# EAGLE schematic untitled (EAGLE 9.6.2)
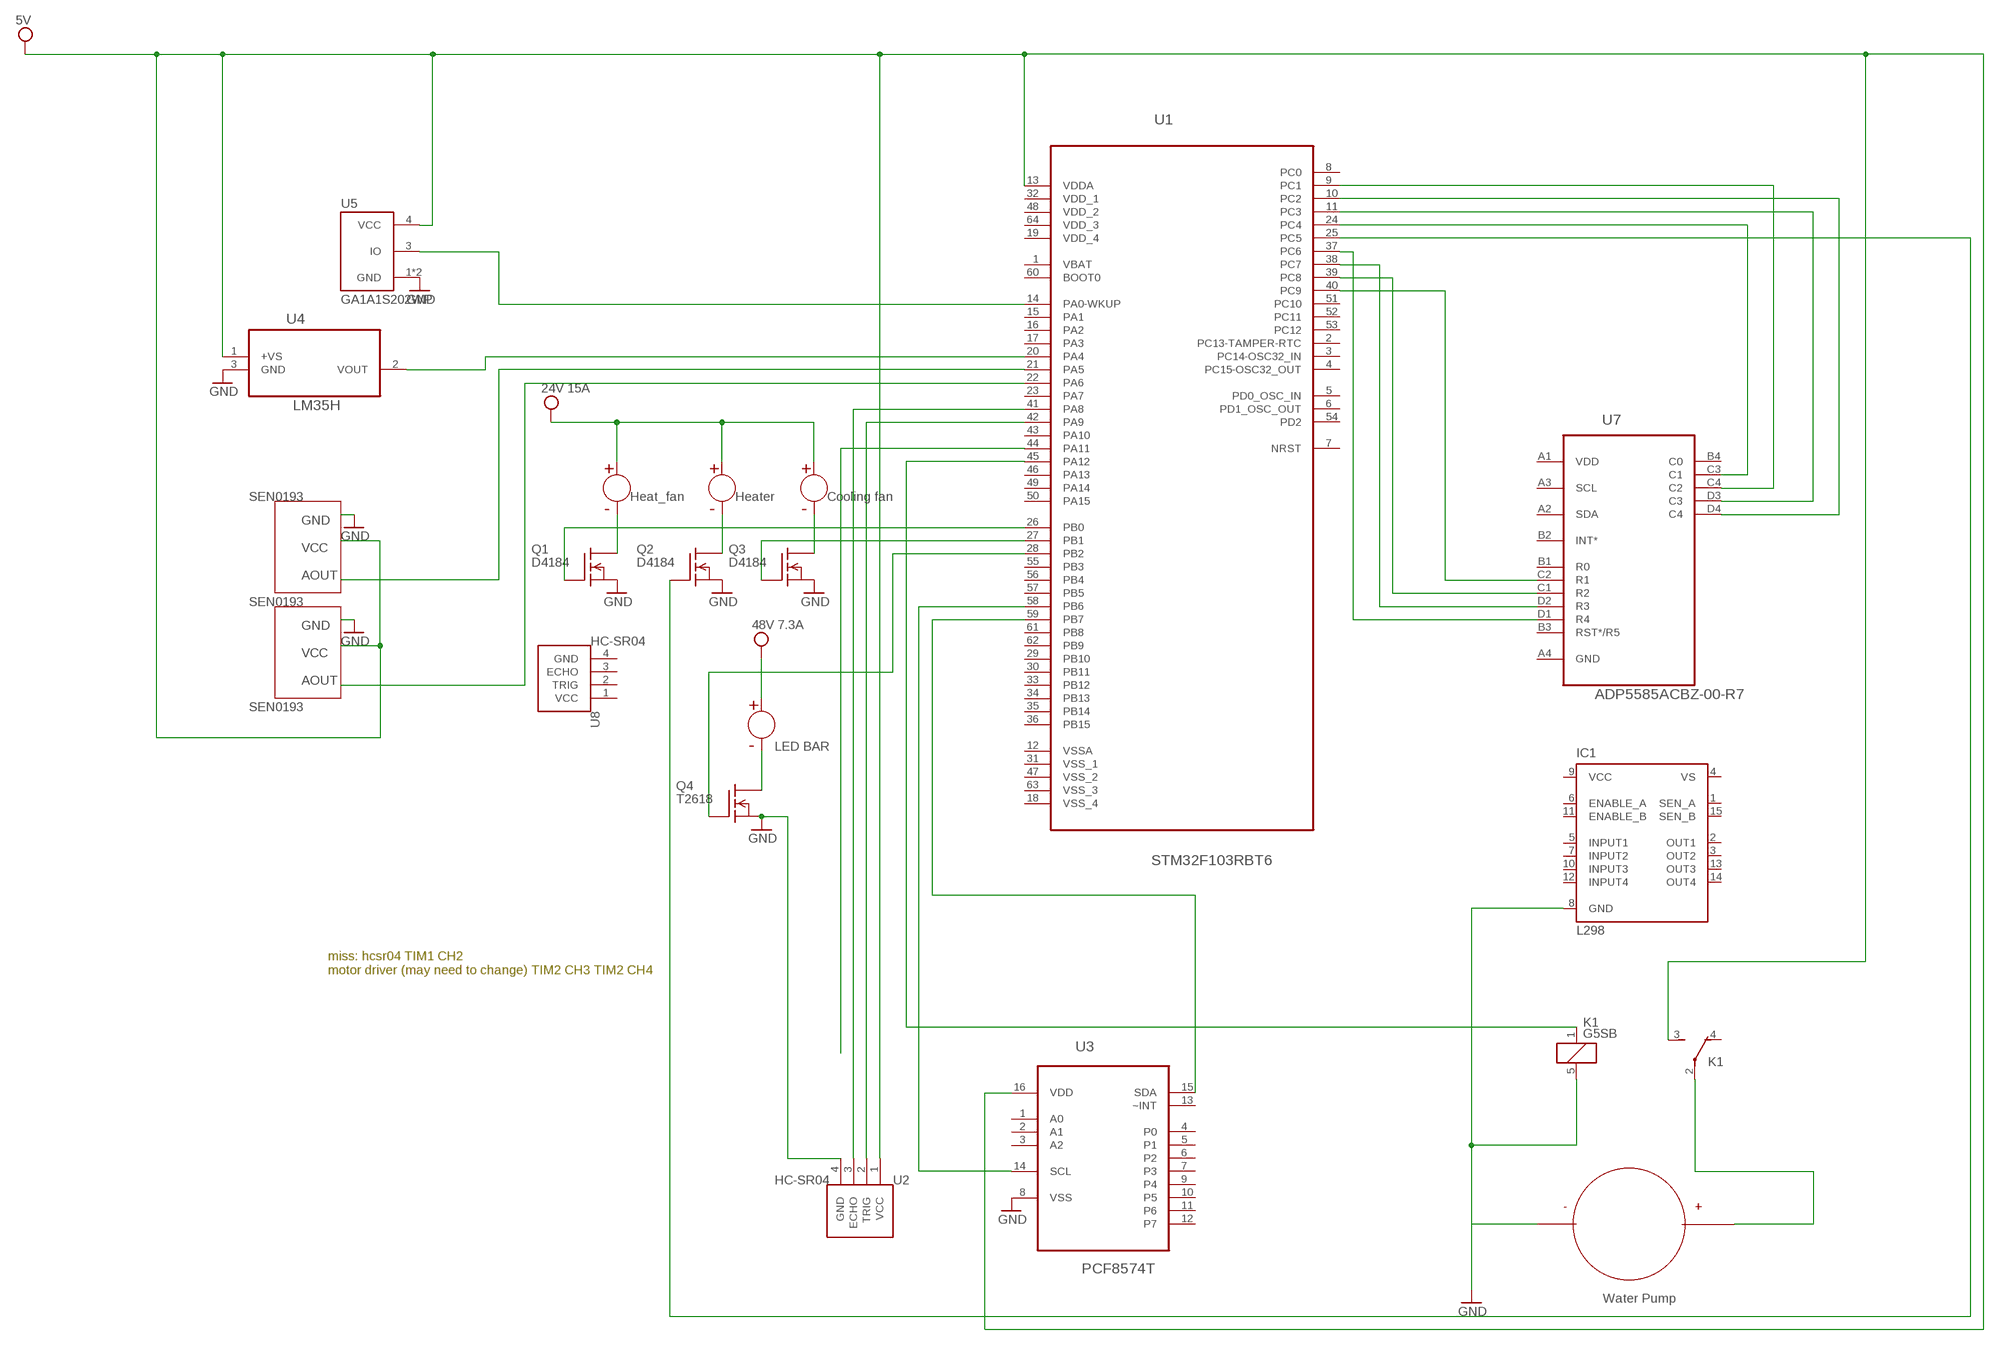
[diagram p0: schematic, sheet 1]

## Parts
IC1  L298  [MULTIWATT-15]
K1  G5SB  [G5SB]
Q1  D4184  BSS101  [TO92]
Q2  D4184  BSS101  [TO92]
Q3  D4184  BSS101  [TO92]
Q4  T2618  BSS101  [TO92]
U1  STM32F103RBT6  [QFP50P1200X1200X160-64N]
U2  HC-SR04  [XCVR_HC-SR04]
U3  PCF8574T  [SOIC127P1032X265-16N]
U4  LM35H  [TO127P543X266-3P]
U5  GA1A1S202WP  [XDCR_GA1A1S202WP]
U7  ADP5585ACBZ-00-R7  [BGA16C40P4X4_159X159X54]
U8  HC-SR04  [XCVR_HC-SR04]

## Nets
GND: IC1.8(GND) K1.5 Q1.1(S) Q2.1(S) Q3.1(S) Q4.1(S) U2.4(GND) U3.8(VSS) U4.3(GND) U5.1(GND) U5.2(GND)
N$1: U1.14(PA0-WKUP) U5.3(IO)
N$2: U1.20(PA4) U4.2(VOUT)
N$3: U1.22(PA6)
N$4: U1.21(PA5)
N$5: K1.1 U1.45(PA12)
N$6: U1.24(PC4) U7.C3(C1)
N$7: Q1.2(G) U1.26(PB0)
N$8: Q1.3(D)
N$9: Q2.2(G) U1.25(PC5)
N$10: Q2.3(D)
N$11: Q3.2(G) U1.27(PB1)
N$12: Q3.3(D)
N$13: Q4.3(D)
N$14: Q4.2(G) U1.28(PB2)
N$15: U1.41(PA8) U2.3(ECHO)
N$16: U1.42(PA9) U2.2(TRIG)
N$17: U1.58(PB6) U3.14(SCL)
N$18: U1.59(PB7) U3.15(SDA)
N$19: U1.40(PC9) U7.C2(R1)
N$20: U1.39(PC8) U7.C1(R2)
N$21: U1.38(PC7) U7.D2(R3)
N$22: U1.37(PC6) U7.D1(R4)
N$23: U1.9(PC1) U7.C4(C2)
N$24: U1.11(PC3) U7.D3(C3)
N$25: U1.10(PC2) U7.D4(C4)
N$27: U1.44(PA11)
N$29: K1.2(U:P)
VCC: K1.3(U:S) U1.13(VDDA) U2.1(VCC) U3.16(VDD) U4.1(+VS) U5.4(VCC) ; supply symbol labelled 5V, 24V 15A, 48V 7.3A
Unconnected: IC1.1(SEN_A) IC1.2(OUT1) IC1.3(OUT2) IC1.5(INPUT1) IC1.6(ENABLE_A) IC1.7(INPUT2) IC1.10(INPUT3) IC1.11(ENABLE_B) IC1.12(INPUT4) IC1.13(OUT3) IC1.14(OUT4) IC1.15(SEN_B) K1.4(U:O) U1.1(VBAT) U1.2(PC13-TAMPER-RTC) U1.3(PC14-OSC32_IN) U1.4(PC15-OSC32_OUT) U1.5(PD0_OSC_IN) U1.6(PD1_OSC_OUT) U1.7(NRST) U1.8(PC0) U1.12(VSSA) U1.15(PA1) U1.16(PA2) U1.17(PA3) U1.18(VSS_4) U1.23(PA7) U1.29(PB10) U1.30(PB11) U1.31(VSS_1) U1.33(PB12) U1.34(PB13) U1.35(PB14) U1.36(PB15) U1.43(PA10) U1.46(PA13) U1.47(VSS_2) U1.49(PA14) U1.50(PA15) U1.51(PC10) U1.52(PC11) U1.53(PC12) U1.54(PD2) U1.55(PB3) U1.56(PB4) U1.57(PB5) U1.60(BOOT0) U1.61(PB8) U1.62(PB9) U1.63(VSS_3) U3.1(A0) U3.2(A1) U3.3(A2) U3.4(P0) U3.5(P1) U3.6(P2) U3.7(P3) U3.9(P4) U3.10(P5) U3.11(P6) U3.12(P7) U3.13(~INT) U7.A2(SDA) U7.A3(SCL) U7.A4(GND) U7.B1(R0) U7.B2(INT*) U7.B3(RST*/R5) U7.B4(C0) U8.2(TRIG) U8.3(ECHO)

## Notes on the sheet
- + | + | +
- SEN0193 | Heat_fan | Heater | Cooling fan
- - | - | -
- GND
  
  VCC
  
  AOUT
- SEN0193
- GND
  
  VCC
  
  AOUT
- SEN0193 | +
- - | LED BAR
- miss: hcsr04 TIM1 CH2
  motor driver (may need to change) TIM2 CH3 TIM2 CH4
- - | +
- Water Pump

## Power pins joined to a net without a drawn wire
GND: U8.4(GND)
VCC: IC1.9(VCC) U8.1(VCC)
VDD: U7.A1(VDD)
VDD_1: U1.32(VDD_1)
VDD_2: U1.48(VDD_2)
VDD_3: U1.64(VDD_3)
VDD_4: U1.19(VDD_4)
VS: IC1.4(VS)

## Library data of the parts
IC1 = st-microelectronics:L298: DUAL FULL-BRIDGE DRIVER; MPN: L298N; OC_FARNELL: 1589425; OC_NEWARK: 32M1527
K1 = relay:G5SB: Compact Single-pole Relay for Switching 5 A Source: http://www.omron.com/ecb/products/pry/121/g5sb.html; OC_FARNELL: unknown; OC_NEWARK: unknown
Q1-Q4 = transistor-fet:BSS101: N-Channel Enhancement MOSFET 200V; 0,16A; 11Ohm
U1 = STM32F103RBT6:STM32F103RBT6: 32BIT MCU Check prices <https://pricing.snapeda.com/parts/STM32F103RBT6/STMicroelectronics/view-part?ref=eda>; AVAILABILITY: Warning; DESCRIPTION: ARM® Cortex®-M3 STM32F1 Microcontroller IC 32-Bit 72MHz 128KB (128K x 8) FLASH 64-LQFP (10x10); MF: STMicroelectronics; MP: STM32F103RBT6; PACKAGE: LQFP-64 STMicroelectronics; PRICE: None; PURCHASE-URL: https://pricing.snapeda.com/search/part/STM32F103RBT6/?ref=eda
U2 U8 = HC-SR04:HC-SR04: Ultrasonic Sensor Module Check prices <https://pricing.snapeda.com/parts/HC-SR04/OSEPP%20Electronics%20LTD/view-part?ref=eda>; AVAILABILITY: Warning; DESCRIPTION: HC-SR04 Ultrasonic Sensor Platform Evaluation Expansion Board; MF: OSEPP Electronics LTD; MP: HC-SR04; PACKAGE: None; PRICE: None; PURCHASE-URL: https://pricing.snapeda.com/search/part/HC-SR04/?ref=eda
U3 = PCF8574T:PCF8574T: Remote 8-bit I/O expander for I2C-bus Check prices <https://pricing.snapeda.com/parts/PCF8574T/NXP%20Semiconductors/view-part?ref=eda>; AVAILABILITY: Bad; DESCRIPTION: I/O Expander 8 I²C 100kHz 20-SSOP; MF: NXP Semiconductors; MP: PCF8574T; PACKAGE: SOIC-16 NXP Semiconductors; PRICE: None
U4 = LM35H:LM35H: IC, TEMPERATURE SENSOR, ± 0.2°C Check prices <https://pricing.snapeda.com/parts/LM35H/Texas%20Instruments/view-part?ref=eda>; AVAILABILITY: Warning; DESCRIPTION: &plusmn;0.5&deg;C 4V-30V, Temperature sensor with analog output 3-TO -55 to 150; MF: Texas Instruments; MP: LM35H; PACKAGE: TO-CAN-3 Texas Instruments; PRICE: None; PURCHASE-URL: https://pricing.snapeda.com/search/part/LM35H/?ref=eda
U5 = GA1A1S202WP:GA1A1S202WP: Optical Sensor Ambient 555nm Current 4-SMD, No Lead Check prices <https://pricing.snapeda.com/parts/GA1A1S202WP/Sharp%20Microelectronics/view-part?ref=eda>; AVAILABILITY: Bad; DESCRIPTION: Optical Sensor Ambient 555nm Current 4-SMD, No Lead; MF: Sharp Microelectronics; MP: GA1A1S202WP; PACKAGE: SMD-4 Sharp Microelectronics; PRICE: None
U7 = ADP5585ACBZ-00-R7:ADP5585ACBZ-00-R7: WLCSP-16,Keypad Decoder and I/O Expansion Check prices <https://pricing.snapeda.com/parts/ADP5585ACBZ-00-R7/Analog%20Devices/view-part?ref=eda>; AVAILABILITY: Warning; DESCRIPTION: Keypad Entries, I/O Expansion Interface 16-WLCSP (1.59x1.59); MF: Analog Devices; MP: ADP5585ACBZ-00-R7; PACKAGE: WLCSP -16 Analog Devices; PRICE: None; PURCHASE-URL: https://pricing.snapeda.com/search/part/ADP5585ACBZ-00-R7/?ref=eda